# Altium project PD_SMARTKEY_EMN-EVAN_V2.0.PrjPcb
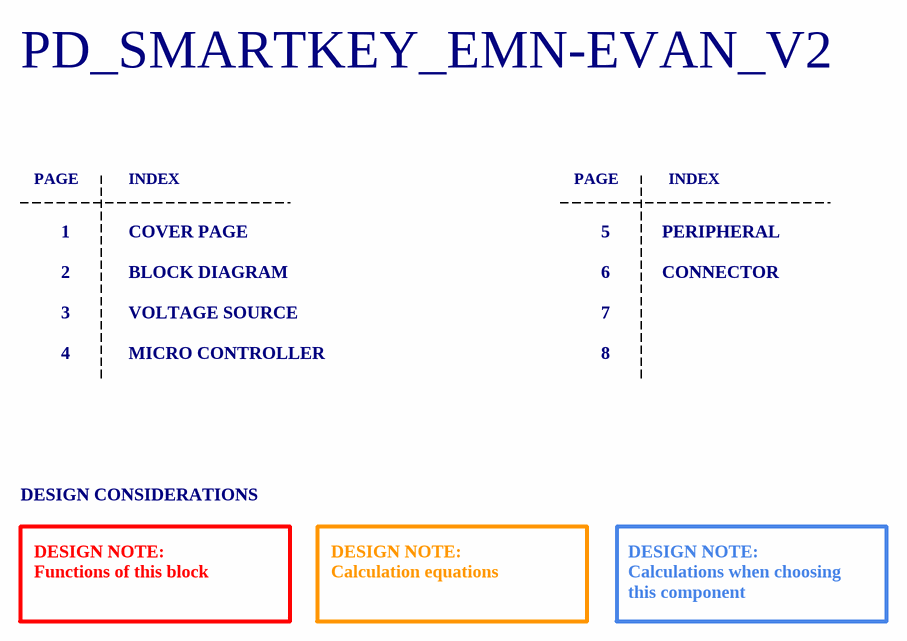
[diagram p0: Cover Page.SchDoc]
6 sheets, 132 parts. Net scope: global (net labels, ports and power ports of the same name join across sheets).
Board file: PD_SMARTKEY_EMN-EVAN_V2.0.PcbDoc
Sheets:
  Cover Page.SchDoc
  Block Diagram.SchDoc
  Voltage Source.SchDoc
  Micro Controller.SchDoc
  Peripheral.SchDoc
  Connector.SchDoc

## Sheet Cover Page.SchDoc
size A4; SheetNumber: 1; SheetTotal: 6; ProjectTitle: PD_SMARTKEY_EMN-EVAN_V2

### Notes on the sheet
- PD_SMARTKEY_EMN-EVAN_V2
- PAGE
- INDEX
- 1
- 2
- COVER PAGE
- BLOCK DIAGRAM
- 5
- 6
- PERIPHERAL
- CONNECTOR
- 3
- 4
- VOLTAGE SOURCE
- MICRO CONTROLLER
- 7
- 8
- DESIGN CONSIDERATIONS
- DESIGN NOTE:
  Functions of this block
- DESIGN NOTE:
  Calculation equations
- DESIGN NOTE:
  Calculations when choosing this component
- Author:
- Title:
- Size:
- A4
- Project:
- Approved:
- Revision:
- Modified Date:
- CONFIDENTIAL
- Date:
- SW Version:

## Sheet Block Diagram.SchDoc
size A4; SheetNumber: 2; SheetTotal: 6; ProjectTitle: PD_SMARTKEY_EMN-EVAN_V2

### Notes on the sheet
- Author:
- Title:
- Size:
- A4
- Project:
- Approved:
- Revision:
- Modified Date:
- CONFIDENTIAL
- Date:
- SW Version:

## Sheet Voltage Source.SchDoc
size A4; SheetNumber: 3; SheetTotal: 6; ProjectTitle: PD_SMARTKEY_EMN-EVAN_V2
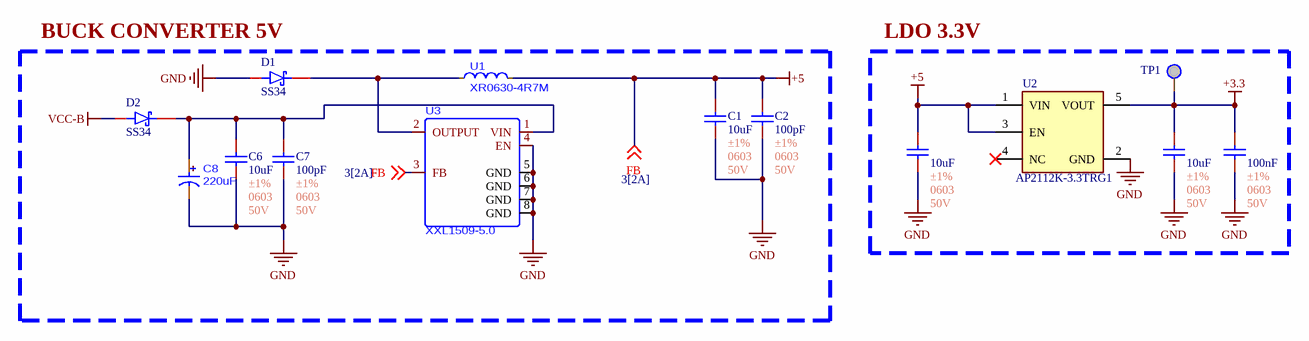
[diagram p1: Voltage Source.SchDoc]

### Parts
C1  10uF  Tolerance: ±1%  Package: 0603  Voltage Rating: 50V  [C0603]
C2  100pF  Tolerance: ±1%  Package: 0603  Voltage Rating: 50V  [C0603]
C3  10uF  Tolerance: ±1%  Package: 0603  Voltage Rating: 50V  [C0603]
C4  10uF  Tolerance: ±1%  Package: 0603  Voltage Rating: 50V  [C0603]
C5  100nF  Tolerance: ±1%  Package: 0603  Voltage Rating: 50V  [C0603]
C6  10uF  Tolerance: ±1%  Package: 0603  Voltage Rating: 50V  [C0603]
C7  100pF  Tolerance: ±1%  Package: 0603  Voltage Rating: 50V  [C0603]
C8  220uF  [C_220uF_35V_SMD]
D1  SS34  [SS34]
D2  SS34  [SS34]
TP1  TP  [TP]  (value not drawn)
U1  XR0630-4R7M  [SMD,7x6.6mm]
U2  AP2112K-3.3TRG1  [SOT23-5]
U3  XXL1509-5.0  [XXL1509-5.0]

### Blocks framed on the sheet
BUCK CONVERTER 5V: C1 C2 C6-C8 D1 D2 U1 U3
LDO 3.3V: C3-C5 TP1 U2

### Nets
+3.3: C4.1 C5.1 TP1.1 U2.5(VOUT)
+5: C1.1 C2.1 C3.1 U1.2(F) U2.1(VIN) U2.3(EN) U3.3(FB) ; off-sheet FB  [also labelled FB]
GND: C1.2 C2.2 C3.2 C4.2 C5.2 C6.2 C7.2 C8.2 D1.2 U2.2(GND) U3.4(EN) U3.5(GND) U3.6(GND) U3.7(GND) U3.8(GND)
VCC-B: D2.2
NetC6_1: C6.1 C7.1 C8.1 D2.1 U3.1(VIN)
NetD1_1: D1.1 U1.1(S) U3.2(OUTPUT)

Not connected (* = marked no-connect by the designer): U2 4(NC)*

### Notes on the sheet
- Author:
- Title:
- Size:
- A4
- Project:
- Approved:
- Revision:
- Modified Date:
- CONFIDENTIAL
- Date:
- SW Version:

### Library data of the parts
C1 C6 = C0603_10uF_±1%: Manufacturer: YAGEO; Mfr. Part #: CC0402FRNPO9BN100; LCSC Part #: C513681; Link: https://www.lcsc.com/product-detail/C513681.html?s_z=n_capital%2520yageo%252010pF%25200402; Capacitance: 10uF
C2 C7 = C0603_100pF_±1%: Manufacturer: YAGEO; Mfr. Part #: CC0402FRNPO9BN100; LCSC Part #: C513681; Link: https://www.lcsc.com/product-detail/C513681.html?s_z=n_capital%2520yageo%252010pF%25200402; Capacitance: 100pF
C3 C4 = C0603_10uF_±1%: 50V 10pF NP0 ±1% 0402 Multilayer Ceramic Capacitors MLCC - SMD/SMT ROHS; Manufacturer: YAGEO; Mfr. Part #: CC0402FRNPO9BN100; LCSC Part #: C513681; Link: https://www.lcsc.com/product-detail/C513681.html?s_z=n_capital%2520yageo%252010pF%25200402; Capacitance: 10uF
C5 = C0603_100nF_±1%: 50V 10pF NP0 ±1% 0402 Multilayer Ceramic Capacitors MLCC - SMD/SMT ROHS; Manufacturer: YAGEO; Mfr. Part #: CC0402FRNPO9BN100; LCSC Part #: C513681; Link: https://www.lcsc.com/product-detail/C513681.html?s_z=n_capital%2520yageo%252010pF%25200402; Capacitance: 100nF
C8 = C_220uF_35V_SMD: CAP ALUM 220uF ±20% 35V SMD; Manufacturer: ROQANG; Mfr. Part #: RVT1V221M0810; LCSC Part #: C72498; Package: SMD,D8xL10.2mm; Link: https://www.lcsc.com/product-detail/C72498.html?s_z=n_q_t_220u%252035v&spm=wm.fly.bg.0.xh___wm.ssy.tc.0.tz&lcsc_vid=FlRcBlcDRFNZAlJQT1RZBVJSEVFcX11eRVQPBFEHFgAxVlNeT1ReUlJRRFFYVTsOAxUeFF5JWBYZEEoKFBINSQcJGk4NBhADEA4cHktfT1FADxALGw%3D%3D
D1 D2 = SS34: 40V Independent 3A 550mV@3A SMA(DO-214AC) Schottky Diodes ROHS; Manufacturer: MDD(Microdiode Semiconductor); Mfr. Part #: SS34; LCSC Part #: C8678; Package: SMA(DO-214AC); Voltage - DC Reverse(Vr): 40V; Current - Rectified: 3A; Link: https://www.lcsc.com/product-detail/C8678.html?s_z=n_SS34
U1 = FIXED IND 4.7uH 6A 33mΩ SMD,0630: Manufacturer: XR; MPN: XR0630-4R7M; LCSC Part #: C5307631; Packaging: SMD,7x6.6mm; Link: https://www.lcsc.com/product-detail/C5307631.html?s_z=n_q_t_INDUCTOR%25200630&spm=wm.fly.bg.0.xh___wm.ssy.tc.0.tz&lcsc_vid=FFlaVlZURFlbX1EAE1lbUlZfQwdeBlBRQ1VZBFdQQwUxVlNeRlRfU1ZRQlNZXzsOAxUeFF5JWBYZEEoKFBINSQcJGk4eFQsCAgIaSgADAwAHC0slQ1ZXV1NWWQkaCgg%3D
U2 = AP2112K-3.3TRG1: Linear Voltage Regulator IC Positive Fixed 1 Output 600mA SOT23-5; MF: Diodes Inc.; Value: *; Purchase-URL: https://pricing.snapeda.com/search/part/AP2112K-3.3TRG1/?ref=eda; Package: SOT-753 Diodes Inc.; Availability: In Stock; Check_prices: https://www.snapeda.com/parts/AP2112K-3.3TRG1/Diodes+Inc./view-part/?ref=eda; Price: None; SnapEDA_Link: https://www.snapeda.com/parts/AP2112K-3.3TRG1/Diodes+Inc./view-part/?ref=snap; MP: AP2112K-3.3TRG1
U3 = XXL1509-5.0: 150KHz 3A PWM Buck DC/DC Converter; Manufacturer: UMW; MPN: XXL1509-5.0; LCSC Part #: C42376977; Packaging: SOP-8; Link: https://www.lcsc.com/product-detail/C42376977.html?s_z=n_q_xl1509&spm=wm.fly.bg.0.xh&lcsc_vid=FlRcBlcDRFNZAlJQT1RZBVJSEVFcX11eRVQPBFEHFgAxVlNeT1VdVlFURVJWXjsOAxUeFF5JWBYZEEoKFBINSQcJGk4eFQsCAgIaSgADAwAHC0slRVheUFFQQE8GEwkK

## Sheet Micro Controller.SchDoc
size A4; SheetNumber: 4; SheetTotal: 6; ProjectTitle: PD_SMARTKEY_EMN-EVAN_V2
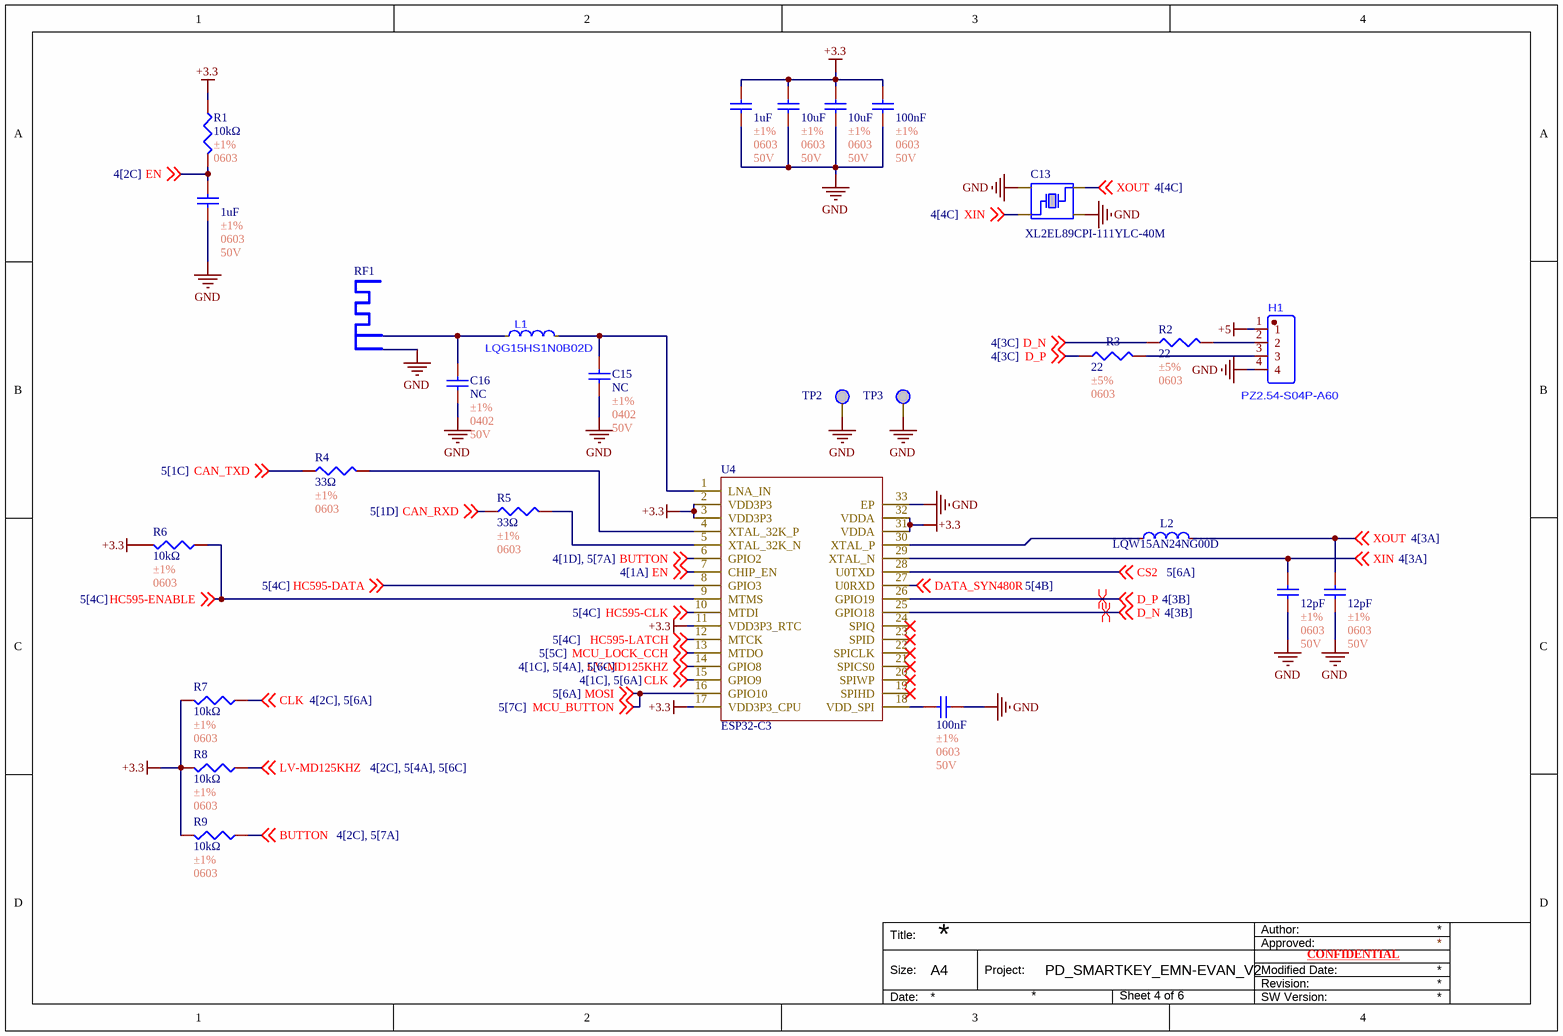
[diagram p2: Micro Controller.SchDoc]

### Parts
C9  1uF  Tolerance: ±1%  Package: 0603  Voltage Rating: 50V  [C0603]
C10  10uF  Tolerance: ±1%  Package: 0603  Voltage Rating: 50V  [C0603]
C11  10uF  Tolerance: ±1%  Package: 0603  Voltage Rating: 50V  [C0603]
C12  100nF  Tolerance: ±1%  Package: 0603  Voltage Rating: 50V  [C0603]
C13  XL2EL89CPI-111YLC-40M  [XL2EL89CPI-111YLC-40M]
C14  1uF  Tolerance: ±1%  Package: 0603  Voltage Rating: 50V  [C0603]
C15  NC  Tolerance: ±1%  Package: 0402  Voltage Rating: 50V  [C0402]
C16  NC  Tolerance: ±1%  Package: 0402  Voltage Rating: 50V  [C0402]
C17  12pF  Tolerance: ±1%  Package: 0603  Voltage Rating: 50V  [C0603]
C18  12pF  Tolerance: ±1%  Package: 0603  Voltage Rating: 50V  [C0603]
C19  100nF  Tolerance: ±1%  Package: 0603  Voltage Rating: 50V  [C0603]
H1  PZ2.54-S04P-A60  [J_4P_XH2.54]
L1  LQG15HS1N0B02D  [L0402_1nH]
L2  LQW15AN24NG00D  [LQW15AN24NG00D]
R1  10kΩ  Tolerance: ±1%  Package: 0603  [R0603]
R2  22  Tolerance: ±5%  Package: 0603  [R0603]
R3  22  Tolerance: ±5%  Package: 0603  [R0603]
R4  33Ω  Tolerance: ±1%  Package: 0603  [R0603]
R5  33Ω  Tolerance: ±1%  Package: 0603  [R0603]
R6  10kΩ  Tolerance: ±1%  Package: 0603  [R0603]
R7  10kΩ  Tolerance: ±1%  Package: 0603  [R0603]
R8  10kΩ  Tolerance: ±1%  Package: 0603  [R0603]
R9  10kΩ  Tolerance: ±1%  Package: 0603  [R0603]
RF1  (no value)  [2.4GHZ-50OHMS_v1.1]
TP2  TP  [TP]  (value not drawn)
TP3  TP  [TP]  (value not drawn)
U4  ESP32-C3  [ESP32-C3]

### Nets
+3.3: C9.1 C10.1 C11.1 C12.1 R1.1 R6.2 R7.2 R8.2 R9.2 U4.2(VDD3P3) U4.3(VDD3P3) U4.11(VDD3P3_RTC) U4.17(VDD3P3_CPU) U4.31(VDDA) U4.32(VDDA)
+5: H1.1
GND: C9.2 C10.2 C11.2 C12.2 C13.2 C13.4 C14.2 C15.2 C16.2 C17.2 C18.2 C19.2 H1.4 RF1.2 TP2.1 TP3.1 U4.33(EP)
BUTTON: R9.1 U4.6(GPIO2) ; off-sheet BUTTON
CAN_RXD: R5.1 ; off-sheet CAN_RXD
CAN_TXD: R4.1 ; off-sheet CAN_TXD
CLK: R7.1 U4.15(GPIO9) ; off-sheet CLK
CS2: U4.28(U0TXD) ; off-sheet CS2
D_N: R2.1 U4.25(GPIO18) ; off-sheet D_N
D_P: R3.1 U4.26(GPIO19) ; off-sheet D_P
DATA_SYN480R: U4.27(U0RXD) ; off-sheet DATA_SYN480R
EN: C14.1 R1.2 U4.7(CHIP_EN) ; off-sheet EN
HC595-CLK: U4.10(MTDI) ; off-sheet HC595-CLK
HC595-DATA: U4.8(GPIO3) ; off-sheet HC595-DATA
HC595-ENABLE: R6.1 U4.9(MTMS) ; off-sheet HC595-ENABLE
HC595-LATCH: U4.12(MTCK) ; off-sheet HC595-LATCH
LV-MD125KHZ: R8.1 U4.14(GPIO8) ; off-sheet LV-MD125KHZ
MCU_BUTTON: U4.16(GPIO10) ; off-sheet MOSI, off-sheet MCU_BUTTON  [also labelled MOSI]
MCU_LOCK_CCH: U4.13(MTDO) ; off-sheet MCU_LOCK_CCH
XIN: C13.1 C17.1 U4.29(XTAL_N) ; off-sheet XIN
XOUT: C13.3 C18.1 L2.2 ; off-sheet XOUT
NetC15_1: C15.1 L1.2 U4.1(LNA_IN)
NetC16_1: C16.1 L1.1 RF1.1
NetC19_1: C19.1 U4.18(VDD_SPI)
NetH1_2: H1.2 R2.2
NetH1_3: H1.3 R3.2
NetL2_1: L2.1 U4.30(XTAL_P)
NetR4_2: R4.2 U4.4(XTAL_32K_P)
NetR5_2: R5.2 U4.5(XTAL_32K_N)

Not connected (* = marked no-connect by the designer): U4 19(SPIHD)* 20(SPIWP)* 21(SPICS0)* 22(SPICLK)* 23(SPID)* 24(SPIQ)*

### Layout directives
differential pair: D_N, D_P

### Notes on the sheet
- Author:
- Title:
- Size:
- A4
- Project:
- Approved:
- Revision:
- Modified Date:
- CONFIDENTIAL
- Date:
- SW Version:

### Library data of the parts
C9 C14 = C0603_1uF_±1%: 50V 10pF NP0 ±1% 0402 Multilayer Ceramic Capacitors MLCC - SMD/SMT ROHS; Manufacturer: YAGEO; Mfr. Part #: CC0402FRNPO9BN100; LCSC Part #: C513681; Link: https://www.lcsc.com/product-detail/C513681.html?s_z=n_capital%2520yageo%252010pF%25200402; Capacitance: 1uF
C10 C11 = C0603_10uF_±1%: as C3 on sheet Voltage Source; LCSC Part #: C513681; Link: https://www.lcsc.com/product-detail/C513681.html?s_z=n_capital%2520yageo%252010pF%25200402; Capacitance: 10uF
C12 C19 = C0603_100nF_±1%: as C5 on sheet Voltage Source; LCSC Part #: C513681; Link: https://www.lcsc.com/product-detail/C513681.html?s_z=n_capital%2520yageo%252010pF%25200402; Capacitance: 100nF
C13 = XL2EL89CPI-111YLC-40M: Crystal Oscillator 15pF SMD3225-4P Crystals RoHS; Manufacturer: YXC Crystal Oscillators; Mfr. Part #: XL2EL89CPI-111YLC-40M; LCSC Part #: C5444549; Package: SMD3225-4P; Link: https://www.lcsc.com/product-detail/C5444549.html?s_z=n_oscillator; Key Attributes: Crystal Oscillator 15pF SMD3225-4P Crystals RoHS
C15 C16 = C0402_NC_±1%: Manufacturer: YAGEO; Mfr. Part #: CC0402FRNPO9BN100; Capacitance: 1uF; LCSC Part #: C513681; Link: https://www.lcsc.com/product-detail/C513681.html?s_z=n_capital%2520yageo%252010pF%25200402
C17 C18 = C0603_12pF_±1%: 50V 10pF NP0 ±1% 0402 Multilayer Ceramic Capacitors MLCC - SMD/SMT ROHS; Manufacturer: YAGEO; Mfr. Part #: CC0402FRNPO9BN100; LCSC Part #: C513681; Link: https://www.lcsc.com/product-detail/C513681.html?s_z=n_capital%2520yageo%252010pF%25200402; Capacitance: 12pF
H1 = J_4P_XH2.54: 1kV 1 2.54mm Pin Header 3A 2.5mm Through Hole 6mm -40℃~+105℃ 3mm Gold 4P Black 1x4P Through Hole,P=2.54mm Headers, Male Pins RoHS; Manufacturer: JXTCONN; MPN: PZ2.54-S04P-A60; LCSC Part #: C42431795; Packaging: Through Hole,P=2.54mm; Link: https://www.lcsc.com/product-detail/C42431795.html?s_z=n_q_t_header%25204%2520p&spm=wm.fly.bg.0.xh___wm.ssy.tc.0.tz&lcsc_vid=FlRcBlcDRFNZAlJQT1RZBVJSEVFcX11eRVQPBFEHFgAxVlNeQVVcV1RRRlFeUzsOAxUeFF5JWBYZEEoKFBINSQcJGk4dAgUUFAk%3D
L1 = L0402_1nH: FIXED IND 1nH 1A 70mΩ 0402; Manufacturer: muRata; MPN: LQG15HS1N0B02D; LCSC Part #: C162538; Packaging: 0402; Link: https://www.lcsc.com/product-detail/C162538.html?s_z=n_q_0402%2520inductor%25201nH&spm=wm.fly.bg.1.xh&lcsc_vid=FFlaVlZURFlbX1EAE1lbUlZfQwdeBlBRQ1VZBFdQQwUxVlNeQ1FfVlBVRFlZVjsOAxUeFF5JWBYZEEoKFBINSQcJGk4NBhADEA4cHktXRllfSQwSGg0%3D
L2 = LQW15AN24NG00D: FIXED IND 24nH 280mA 520mΩ 0402; Manufacturer: muRata; Mfr. Part #: LQW15AN24NG00D; LCSC Part #: C167472; Package: 0402; Link: https://www.lcsc.com/product-detail/C167472.html?s_z=n_q_inductor%252024nH%25200402&spm=wm.fly.bg.0.xh&lcsc_vid=FlRcBlcDRFNZAlJQT1RZBVJSEVFcX11eRVQPBFEHFgAxVlNeQVRfUFJVQVNZUzsOAxUeFF5JWBYZEEoKFBINSQcJGk4eFQsCAgIaSgADAwAHC0slRlhdU1RSWQkaCgg%3D
R1 R6-R9 = R0603_10kΩ_±1%: 62.5mW Thick Film Resistor 50V ±1% ±200ppm/℃ 10Ω 0402 Chip Resistor - Surface Mount ROHS; Manufacturer: YAGEO; Mfr. Part #: RC0402FR-0710RL; LCSC Part #: C138066; Resistance: 10kΩ; Link: https://www.lcsc.com/product-detail/C138066.html?s_z=n_resistor%25200402%252010R
R2 R3 = R0603_0Ω_±5%: 100mW Thick Film Resistor 75V ±5% 0Ω 0603 Chip Resistor - Surface Mount ROHS; Manufacturer: YAGEO; Mfr. Part #: RC0603JR-070RL; Key Attributes: RES 0Ω ±5% 100mW 0603; LCSC Part #: C95177; Resistance: 0Ω; Link: https://www.lcsc.com/product-detail/C138066.html?s_z=n_resistor%25200402%252010R
R4 R5 = R0603_33Ω_±5%: 100mW Thick Film Resistor 75V ±1% ±200ppm/℃ 2Ω 0603 Chip Resistor - Surface Mount ROHS; Manufacturer: YAGEO; Mfr. Part #: RC0603FR-072RL; Key Attributes: RES 0Ω ±5% 100mW 0603; LCSC Part #: C185341; Resistance: 33Ω; Link: https://www.lcsc.com/product-detail/C185341.html?s_z=n_resistor%2520yageo%25202%25CE%25A9%25200603
RF1 = Antenna
U4 = ESP32-C3: Others 160MHz QFN-32-EP(5x5) RF Transceiver Modules and Modems RoHS; Manufacturer: ESPRESSIF; LCSC Part #: C2838500; Package: QFN-32-EP(5x5); Link: https://www.lcsc.com/product-detail/C2838500.html?s_z=n_ESP32%2520C3; MPN: ESP32-C3

## Sheet Peripheral.SchDoc
size A3; SheetNumber: 5; SheetTotal: 6; ProjectTitle: PD_SMARTKEY_EMN-EVAN_V2
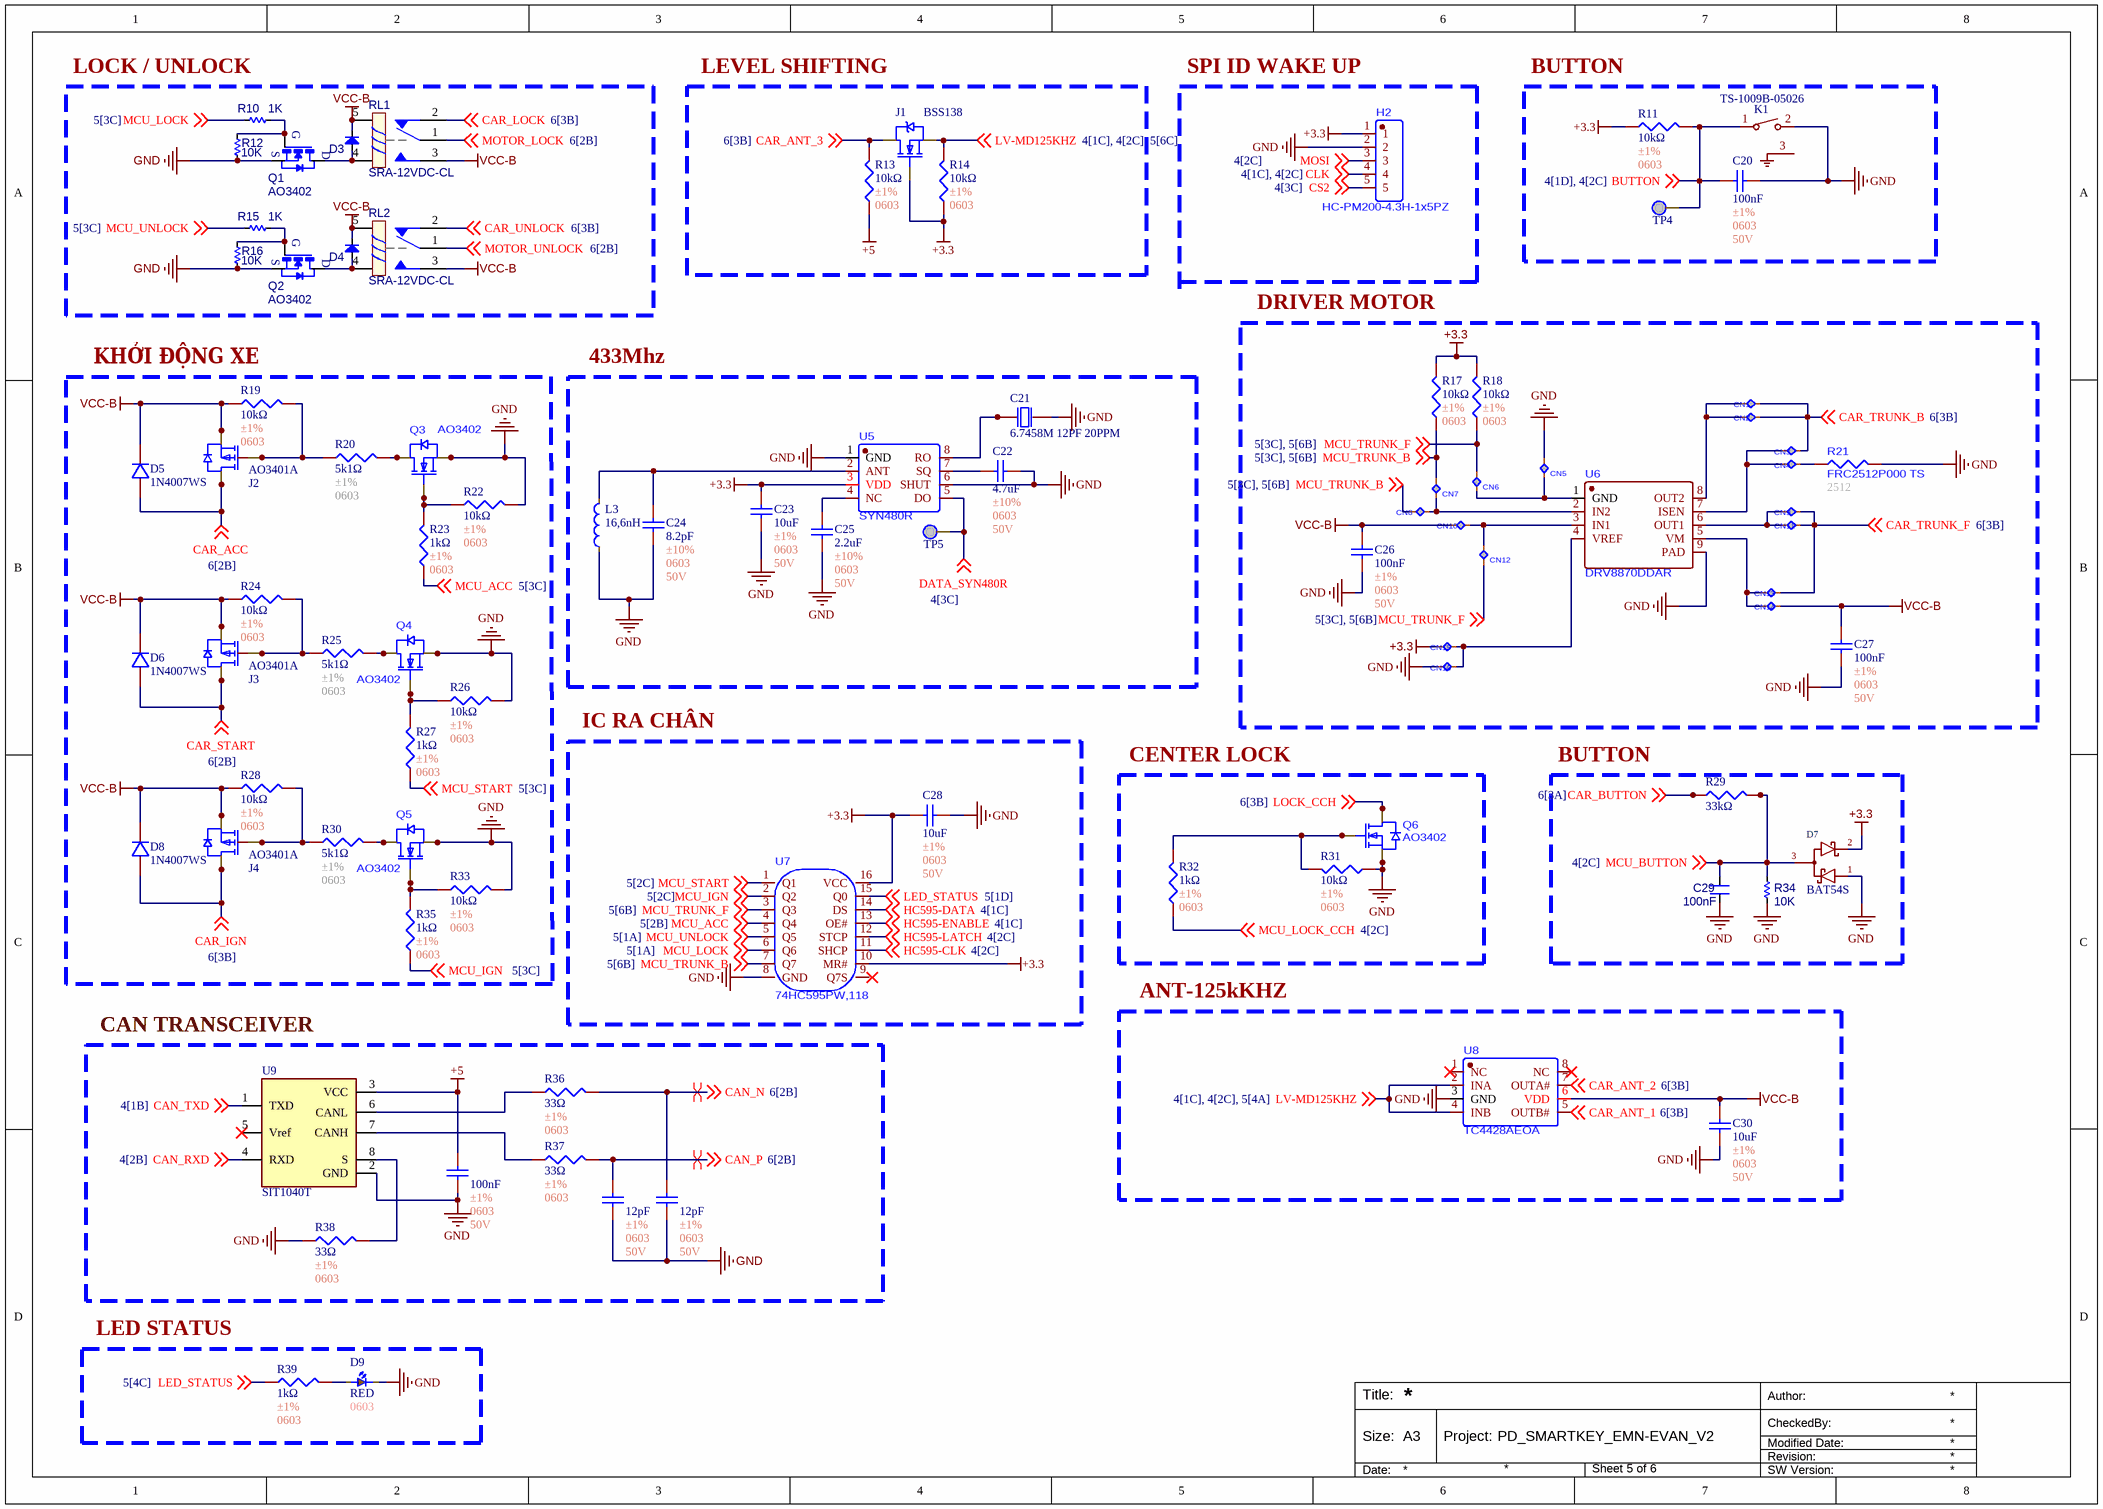
[diagram p3: Peripheral.SchDoc]

### Parts
C20  100nF  Tolerance: ±1%  Package: 0603  Voltage Rating: 50V  [C0603]
C21  6.7458M 12PF 20PPM  [6.7458M 12PF 20PPM]
C22  4.7uF  Tolerance: ±10%  Package: 0603  Voltage Rating: 50V  [C0603]
C23  10uF  Tolerance: ±1%  Package: 0603  Voltage Rating: 50V  [C0603]
C24  8.2pF  Tolerance: ±10%  Package: 0603  Voltage Rating: 50V  [C0603]
C25  2.2uF  Tolerance: ±10%  Package: 0603  Voltage Rating: 50V  [C0603]
C26  100nF  Tolerance: ±1%  Package: 0603  Voltage Rating: 50V  [C0603]
C27  100nF  Tolerance: ±1%  Package: 0603  Voltage Rating: 50V  [C0603]
C28  10uF  Tolerance: ±1%  Package: 0603  Voltage Rating: 50V  [C0603]
C29  100nF  [C-0603]
C30  10uF  Tolerance: ±1%  Package: 0603  Voltage Rating: 50V  [C0603]
C31  100nF  Tolerance: ±1%  Package: 0603  Voltage Rating: 50V  [C0603]
C32  12pF  Tolerance: ±1%  Package: 0603  Voltage Rating: 50V  [C0603]
C33  12pF  Tolerance: ±1%  Package: 0603  Voltage Rating: 50V  [C0603]
CN1  CN  [CN]  (value not drawn)
CN2  CN  [CN]  (value not drawn)
CN3  CN  [CN]  (value not drawn)
CN4  CN  [CN]  (value not drawn)
CN5  CN  [CN]  (value not drawn)
CN6  CN  [CN]  (value not drawn)
CN7  CN  [CN]  (value not drawn)
CN8  CN  [CN]  (value not drawn)
CN9  CN  [CN]  (value not drawn)
CN10  CN  [CN]  (value not drawn)
CN11  CN  [CN]  (value not drawn)
CN12  CN  [CN]  (value not drawn)
CN13  CN  [CN]  (value not drawn)
CN14  CN  [CN]  (value not drawn)
CN15  CN  [CN]  (value not drawn)
CN16  CN  [CN]  (value not drawn)
D3  1N5819  [SOD-323]  (value not drawn)
D4  1N5819  [SOD-323]  (value not drawn)
D5  1N4007WS  [1N4007WS]
D6  1N4007WS  [1N4007WS]
D7  BAT54S  [SOT23-3]
D8  1N4007WS  [1N4007WS]
D9  RED  Package: 0603  [LED0603]
H2  HC-PM200-4.3H-1x5PZ  [JC_5P_XH2.0]
J1  BSS138  [BSS138]
J2  AO3401A  [AO3401]
J3  AO3401A  [AO3401]
J4  AO3401A  [AO3401]
K1  TS-1009B-05026  [TS-1009B-05026]
L3  16,6nH  [L_16,6nH_0603]
Q1  AO3402  [SOT23-3]
Q2  AO3402  [SOT23-3]
Q3  AO3402  [AO3402]
Q4  AO3402  [AO3402]
Q5  AO3402  [AO3402]
Q6  AO3402  [AO3402]
R10  1K  [RES-SMD-0603]
R11  10kΩ  Tolerance: ±1%  Package: 0603  [R0603]
R12  10K  [RES-SMD-0603]
R13  10kΩ  Tolerance: ±1%  Package: 0603  [R0603]
R14  10kΩ  Tolerance: ±1%  Package: 0603  [R0603]
R15  1K  [RES-SMD-0603]
R16  10K  [RES-SMD-0603]
R17  10kΩ  Tolerance: ±1%  Package: 0603  [R0603]
R18  10kΩ  Tolerance: ±1%  Package: 0603  [R0603]
R19  10kΩ  Tolerance: ±1%  Package: 0603  [R0603]
R20  5k1Ω  Tolerance: ±1%  Package: 0603  [R0603]
R21  FRC2512P000 TS  Packaging: 2512  [R_2512_0O ±5%]
R22  10kΩ  Tolerance: ±1%  Package: 0603  [R0603]
R23  1kΩ  Tolerance: ±1%  Package: 0603  [R0603]
R24  10kΩ  Tolerance: ±1%  Package: 0603  [R0603]
R25  5k1Ω  Tolerance: ±1%  Package: 0603  [R0603]
R26  10kΩ  Tolerance: ±1%  Package: 0603  [R0603]
R27  1kΩ  Tolerance: ±1%  Package: 0603  [R0603]
R28  10kΩ  Tolerance: ±1%  Package: 0603  [R0603]
R29  33kΩ  [R0603]
R30  5k1Ω  Tolerance: ±1%  Package: 0603  [R0603]
R31  10kΩ  Tolerance: ±1%  Package: 0603  [R0603]
R32  1kΩ  Tolerance: ±1%  Package: 0603  [R0603]
R33  10kΩ  Tolerance: ±1%  Package: 0603  [R0603]
R34  10K  [RES-SMD-0603]
R35  1kΩ  Tolerance: ±1%  Package: 0603  [R0603]
R36  33Ω  Tolerance: ±1%  Package: 0603  [R0603]
R37  33Ω  Tolerance: ±1%  Package: 0603  [R0603]
R38  33Ω  Tolerance: ±1%  Package: 0603  [R0603]
R39  1kΩ  Tolerance: ±1%  Package: 0603  [R0603]
RL1  SRA-12VDC-CL  [YL318-DC12V-C]
RL2  SRA-12VDC-CL  [YL318-DC12V-C]
TP4  TP  [TP]  (value not drawn)
TP5  TP  [TP]  (value not drawn)
U5  SYN480R  [SYN480R]
U6  DRV8870DDAR  [DRV8870DDAR]
U7  74HC595PW,118  [74HC595PW,118]
U8  TC4428AEOA  [TC4428AEOA]
U9  SIT1040T  [SO8]

### Blocks framed on the sheet
LOCK / UNLOCK: D3 D4 Q1 Q2 R10 R12 R15 R16 RL1 RL2
LEVEL SHIFTING: J1 R13 R14
BUTTON: C20 K1 R11 TP4
DRIVER MOTOR: C26 C27 CN1-CN16 R17 R18 R21 U6
KHỞI ĐỘNG XE: D5 D6 D8 J2-J4 Q3-Q5 R19 R20 R22-R28 R30 R33 R35
433Mhz: C21-C25 L3 TP5 U5
IC RA CHÂN: C28 U7
CENTER LOCK: Q6 R31 R32
BUTTON: C29 D7 R29 R34
ANT-125kKHZ: C30 U8
CAN TRANSCEIVER: C31-C33 R36-R38 U9

### Nets
+3.3: C23.1 C28.1 CN15.1 D7.2(C) H2.1 J1.1(G) R11.1 R14.1 R17.2 R18.2 U5.3(VDD) U7.10(MR#) U7.16(VCC)
+5: C31.1 R13.1 U9.3(VCC)
GND: C20.1 C21.2(OSC2) C22.2 C23.2 C24.2 C25.2 C26.2 C27.2 C28.2 C29.1 C30.2 C31.2 C32.2 C33.2 CN5.1 CN16.1 D7.1(A) D9.1 H2.2 K1.2 L3.1 Q1.2(S) Q2.2(S) Q3.2(S) Q4.2(S) Q5.2(S) Q6.2(S) R12.1 R16.1 R21.2 R22.2 R26.2 R31.1 R33.2 R34.1 R38.1 U5.1(GND) U5.6(SHUT) U6.9(PAD) U7.8(GND) U8.3(GND) U9.2(GND)
VCC-B: C26.1 C27.1 C30.1 CN10.1 CN14.2 D3.2(K) D4.2(K) D5.1(K) D6.1(K) D8.1(K) J2.2(S) J3.2(S) J4.2(S) R19.1 R24.1 R28.1 RL1.3 RL1.5 RL2.3 RL2.5 U8.6(VDD)
BUTTON: C20.2 K1.1 R11.2 TP4.1 ; off-sheet BUTTON
CAN_N: C33.1 R36.2 ; off-sheet CAN_N
CAN_P: C32.1 R37.2 ; off-sheet CAN_P
CAN_RXD: U9.4(RXD) ; off-sheet CAN_RXD
CAN_TXD: U9.1(TXD) ; off-sheet CAN_TXD
CAR_ACC: D5.2(A) J2.3(D) ; off-sheet CAR_ACC
CAR_ANT_1: U8.5(OUTB#) ; off-sheet CAR_ANT_1
CAR_ANT_2: U8.7(OUTA#) ; off-sheet CAR_ANT_2
CAR_ANT_3: J1.3(D) R13.2 ; off-sheet CAR_ANT_3
CAR_BUTTON: R29.1 ; off-sheet CAR_BUTTON
CAR_IGN: D8.2(A) J4.3(D) ; off-sheet CAR_IGN
CAR_LOCK: RL1.2 ; off-sheet CAR_LOCK
CAR_START: D6.2(A) J3.3(D) ; off-sheet CAR_START
CAR_TRUNK_B: CN1.2 CN2.2 CN3.2 ; off-sheet CAR_TRUNK_B
CAR_TRUNK_F: CN9.2 CN11.2 CN13.2 ; off-sheet CAR_TRUNK_F
CAR_UNLOCK: RL2.2 ; off-sheet CAR_UNLOCK
CLK: H2.4 ; off-sheet CLK
CS2: H2.5 ; off-sheet CS2
DATA_SYN480R: TP5.1 U5.5(DO) ; off-sheet DATA_SYN480R
HC595-CLK: U7.11(SHCP) ; off-sheet HC595-CLK
HC595-DATA: U7.14(DS) ; off-sheet HC595-DATA
HC595-ENABLE: U7.13(OE#) ; off-sheet HC595-ENABLE
HC595-LATCH: U7.12(STCP) ; off-sheet HC595-LATCH
LED_STATUS: R39.1 U7.15(Q0) ; off-sheet LED_STATUS
LOCK_CCH: Q6.3(D) ; off-sheet LOCK_CCH
LV-MD125KHZ: J1.2(S) R14.2 U8.2(INA) U8.4(INB) ; off-sheet LV-MD125KHZ
MCU_ACC: R23.1 U7.4(Q4) ; off-sheet MCU_ACC
MCU_BUTTON: C29.2 D7.3 H2.3 R29.2 R34.2 ; off-sheet MOSI, off-sheet MCU_BUTTON  [also labelled MOSI]
MCU_IGN: R35.1 U7.2(Q2) ; off-sheet MCU_IGN
MCU_LOCK: R10.2 U7.6(Q6) ; off-sheet MCU_LOCK
MCU_LOCK_CCH: R32.1 ; off-sheet MCU_LOCK_CCH
MCU_START: R27.1 U7.1(Q1) ; off-sheet MCU_START
MCU_TRUNK_B: CN7.1 CN8.1 R17.1 U7.7(Q7) ; off-sheet MCU_TRUNK_B
MCU_TRUNK_F: CN6.1 CN12.1 R18.1 U7.3(Q3) ; off-sheet MCU_TRUNK_F
MCU_UNLOCK: R15.2 U7.5(Q5) ; off-sheet MCU_UNLOCK
MOTOR_LOCK: RL1.1 ; off-sheet MOTOR_LOCK
MOTOR_UNLOCK: RL2.1 ; off-sheet MOTOR_UNLOCK
NetC21_1: C21.1(OSC1) U5.8(RO)
NetC22_1: C22.1 U5.7(SQ)
NetC24_1: C24.1 L3.2 U5.2(ANT)
NetC25_1: C25.1 U5.4(NC)
NetCN1_1: CN1.1 CN2.1 U6.8(OUT2)
NetCN3_1: CN3.1 CN4.1 U6.7(ISEN)
NetCN4_2: CN4.2 R21.1
NetCN5_2: CN5.2 CN6.2 U6.1(GND)
NetCN7_2: CN7.2 CN8.2 U6.2(IN2)
NetCN9_1: CN9.1 CN11.1 U6.6(OUT1)
NetCN10_2: CN10.2 CN12.2 U6.3(IN1)
NetCN13_1: CN13.1 CN14.1 U6.5(VM)
NetCN15_2: CN15.2 CN16.2 U6.4(VREF)
NetD3_1: D3.1(A) Q1.3(D) RL1.4
NetD4_1: D4.1(A) Q2.3(D) RL2.4
NetD9_2: D9.2 R39.2
NetJ2_1: J2.1(G) R19.2 R20.1
NetJ3_1: J3.1(G) R24.2 R25.1
NetJ4_1: J4.1(G) R28.2 R30.1
NetQ1_1: Q1.1(G) R10.1 R12.2
NetQ2_1: Q2.1(G) R15.1 R16.2
NetQ3_1: Q3.1(G) R22.1 R23.2
NetQ3_3: Q3.3(D) R20.2
NetQ4_1: Q4.1(G) R26.1 R27.2
NetQ4_3: Q4.3(D) R25.2
NetQ5_1: Q5.1(G) R33.1 R35.2
NetQ5_3: Q5.3(D) R30.2
NetQ6_1: Q6.1(G) R31.2 R32.2
NetR36_1: R36.1 U9.6(CANL)
NetR37_1: R37.1 U9.7(CANH)
NetR38_2: R38.2 U9.8(S)

Not connected (* = marked no-connect by the designer): K1 3; U7 9(Q7S); U8 1(NC)* 8(NC)*; U9 5(Vref)*

### Layout directives
differential pair: CAN_N, CAN_P

### Notes on the sheet
- SPI ID WAKE UP
- LED STATUS
- Author:
- Title:
- Size:
- A3
- Project:
- Revision:
- Modified Date:
- CheckedBy:
- Date:
- SW Version:

### Library data of the parts
C20 C26 C27 = C0603_100nF_±1%: Manufacturer: YAGEO; Mfr. Part #: CC0402FRNPO9BN100; LCSC Part #: C513681; Link: https://www.lcsc.com/product-detail/C513681.html?s_z=n_capital%2520yageo%252010pF%25200402; Capacitance: 100nF
C21 = 6.7458M 12PF 20PPM: CRYSTAL 6.7458MHz 12pF SMD; Manufacturer: SOSET; Load Capacitance: 20pF; Mfr. Part #: 6.7458M 12PF 20PPM; LCSC Part #: C4944008; Package: HC-49S-SMD-2P-Mini; Link: https://www.lcsc.com/product-detail/C4944008.html?utm_source=chatgpt.com
C22 = C0603_4.7uF_±10%: Manufacturer: muRata; Mfr. Part #: GCJ188C70J335KE02D; Temperature Coefficient: X7S; LCSC Part #: C710616; Link: https://www.lcsc.com/product-detail/C710616.html?s_z=n_Capita%25200603%25203.3uF%2520yageo; Capacitance: 4.7uF
C23 C28 C30 = C0603_10uF_±1%: as C1 on sheet Voltage Source; LCSC Part #: C513681; Link: https://www.lcsc.com/product-detail/C513681.html?s_z=n_capital%2520yageo%252010pF%25200402; Capacitance: 10uF
C24 = C0603_8.2pF_±10%: Manufacturer: muRata; Mfr. Part #: GCJ188C70J335KE02D; Temperature Coefficient: X7S; LCSC Part #: C710616; Link: https://www.lcsc.com/product-detail/C710616.html?s_z=n_Capita%25200603%25203.3uF%2520yageo; Capacitance: 8.2pF
C25 = C0603_2.2uF_±10%: Manufacturer: muRata; Mfr. Part #: GCJ188C70J335KE02D; Temperature Coefficient: X7S; LCSC Part #: C710616; Link: https://www.lcsc.com/product-detail/C710616.html?s_z=n_Capita%25200603%25203.3uF%2520yageo; Capacitance: 2.2uF
C29 = CM: Cap SMD; Value: 103
C31 = C0603_100nF_±1%: as C5 on sheet Voltage Source; LCSC Part #: C513681; Link: https://www.lcsc.com/product-detail/C513681.html?s_z=n_capital%2520yageo%252010pF%25200402; Capacitance: 100nF
C32 C33 = C0603_12pF_±1%: as C17 on sheet Micro Controller; LCSC Part #: C513681; Link: https://www.lcsc.com/product-detail/C513681.html?s_z=n_capital%2520yageo%252010pF%25200402; Capacitance: 12pF
D3 D4 = Diode SMD: Default Diode; Code - JEDEC: DO-214-AB; Value: 1N5007; Published: 8-Jun-2000; Revision: July-2002: Re-released for DXP Platform.; Publisher: Altium Limited
D5 D6 D8 = 1N4007WS: DIODE STANDARD 1kV 1A SOD-323; Manufacturer: MDD(Microdiode Semiconductor); Mfr. Part #: 1N4007WS; LCSC Part #: C193404; Package: SOD-323; Link: https://www.lcsc.com/product-detail/C193404.html?utm_source=chatgpt.com
D7 = Schottky Dual Diode SMD: Diode 30V 0.2A Surface Mount SOT-23; ki_keywords: Dual Schottky Diode Series; ki_description: Dual Schottky Diode in Series; Datasheet: https://diotec.com/request/datasheet/bat54.pdf
D9 = D0603_RED: 25mcd~40mcd Water Clear -40℃~+85℃ 624nm Red 120° 60mW 0402 LED Indication - Discrete ROHS; Manufacturer: XINGLIGHT; Mfr. Part #: XL-1005UGC; Voltage - Forward(Vf): 3V; LCSC Part #: C965793; Power(Watts): 60mW; Link: https://www.lcsc.com/product-detail/C136765.html?s_z=n_LED%25200402%2520RED; Illumination Color: RED
H2 = JC_5P_XH2.0X_: CONN SOCKET 5POS 2mm SINGLE ROW TH; Manufacturer: Hong Cheng; MPN: HC-PM200-4.3H-1x5PZ; LCSC Part #: C22436139; Packaging: Through Hole,P=2mm; Link: https://www.lcsc.com/product-detail/C22436139.html?utm_source=chatgpt.com
J1 = BSS138: MOSFET N-CH 50V 0.22A SOT-23; Manufacturer: onsemi; Mfr. Part #: BSS138; LCSC Part #: C52895; Package: SOT-23; Link: https://www.lcsc.com/product-detail/C52895.html?s_z=n_q_x_bss138&spm=wm.ssy.em.0.tz&lcsc_vid=FFlaVlZURFlbX1EAE1lbUlZfQwdeBlBRQ1VZBFdQQwUxVlNeQlVeVVZeQlBWUTsOAxUeFF5JWBYZEEoKFBINSQcJGk4eFQsCAgIaSgADAwAHC0slTlBeX1dIHxUDCw%3D%3D
J2-J4 = AO3401: 30V 4A 900mV@250uA 1 P-Channel SOT-23 MOSFETs ROHS; Manufacturer: AOS; Mfr. Part #: AO3401A; LCSC Part #: C15127; Package: SOT-23; Current - Continuous Drain(Id): 4A; Drain to Source Voltage: 30V; Link: https://www.lcsc.com/product-detail/C15127.html?s_z=n_AO3401
K1 = TS-1009B-05026: SWITCH TACTILE SPST TH R/A; Manufacturer: XUNPU; Mfr. Part #: TS-1009B-05026; LCSC Part #: C455252; Package: Through Hole,Right Angle,4.5x4.5mm; Link: https://www.lcsc.com/product-detail/Tactile-Switches_XUNPU_C455252.html?utm_source=chatgpt.com
L3 = L_0603_16.6nH: 700mA 16nH ±5% 170mΩ Wire-wound inductor 0603 Fixed Inductors; Manufacturer: Coilank; Mfr. Part #: HWC1608J16ND; LCSC Part #: C54534274; Package: 0603; Link: https://www.lcsc.com/product-detail/C54534274.html?s_z=n_q_0603%252016nH&spm=wm.fly.bg.0.xh&lcsc_vid=FlRcBlcDRFNZAlJQT1RZBVJSEVFcX11eRVQPBFEHFgAxVlNeQFZdV1BVRFZWVjsOAxUeFF5JWBYZEEoKFBINSQcJGk4NBhADEA4cHktXRllfSQwSGg0%3D; Inductance: 16,6nH
Q1 Q2 = SI2302DS: N-Channel 20V 2.5A _Tc_ 830mW _Tc_ Surface Mount TO-236AB _SOT23_; MF: NXP Semiconductors; SnapEDA_Link: https://www.snapeda.com/parts/SI2302DS/NXP%20Semiconductors/view-part/4701514/?ref=snap; Availability: Unavailable; MP: SI2302DS; Price: None; Value: *; Package: None
Q3-Q6 = AO3402: MOSFET N-CH 30V SOT-23; Manufacturer: AOS; MPN: AO3402; LCSC Part #: C14385; Packaging: SOT-23; Link: https://www.lcsc.com/product-detail/C14385.html?s_z=n_q_ao3402&spm=wm.fly.bg.0.xh&lcsc_vid=FFlaVlZURFlbX1EAE1lbUlZfQwdeBlBRQ1VZBFdQQwUxVlNeRVZXVF1QQ1BYXzsOAxUeFF5JWBYZEEoKFBINSQcJGk4NBhADEA4cHktXR1FWSQwSGg0%3D
R10 R12 R15 R16 R34 = Res-SMD: Resistor; Manufacturer: Generic Components; Class: Passive; Published: 08/06/2000; Publisher: Altium Hobart Technology Centre
R11 R13 R14 R17-R19 R22 R24 R26 R28 R31 R33 = R0603_10kΩ_±1%: as R1 on sheet Micro Controller; LCSC Part #: C138066; Resistance: 10kΩ; Link: https://www.lcsc.com/product-detail/C138066.html?s_z=n_resistor%25200402%252010R
R20 R25 R30 = R0603_5k1Ω_±1%: 100mW Thick Film Resistor 75V ±100ppm/℃ ±1% 5.1kΩ 0603 Chip Resistor - Surface Mount ROHS; Manufacturer: FOJAN; Mfr. Part #: FRC0603F5101TS; Key Attributes: RES 5.1kΩ ±1% 100mW 0603; LCSC Part #: C2907044; Link: https://www.lcsc.com/product-detail/C2907044.html?s_z=n_5k1%25200603; Resistance: 5k1Ω
R21 = R_2512_0Ω ±5%: RES 0Ω ±5% 1W 2512; Manufacturer: FOJAN; MPN: FRC2512P000 TS; LCSC Part #: C2907567; Link: https://www.lcsc.com/product-detail/C2907567.html?s_z=n_q_t_2512%25200R&spm=wm.fly.bg.0.xh___wm.ssy.tc.0.tz&lcsc_vid=FlRcBlcDRFNZAlJQT1RZBVJSEVFcX11eRVQPBFEHFgAxVlNeT1VcVV1UR1dZVTsOAxUeFF5JWBYZEEoKFBINSQcJGk4eFQsCAgIaSgADAwAHC0slT1dbXlRIHxUDCw%3D%3D
R23 R27 R32 R35 R39 = R0603_1kΩ_±1%: 62.5mW Thick Film Resistor 50V ±1% ±200ppm/℃ 10Ω 0402 Chip Resistor - Surface Mount ROHS; Manufacturer: YAGEO; Mfr. Part #: RC0402FR-0710RL; LCSC Part #: C138066; Resistance: 1kΩ; Link: https://www.lcsc.com/product-detail/C138066.html?s_z=n_resistor%25200402%252010R
R29 = R0603_33kΩ_±1%: Manufacturer: YAGEO; Resistance: 33kΩ
R36-R38 = R0603_33Ω_±5%: as R4 on sheet Micro Controller; LCSC Part #: C185341; Resistance: 33Ω; Link: https://www.lcsc.com/product-detail/C185341.html?s_z=n_resistor%2520yageo%25202%25CE%25A9%25200603
RL1 RL2 = Relay 1: Relay SPDT,10A - 12VDC 5 Pin; Value: Relay SPDT, 10A, 12V
U5 = SYN480R: 433/315 MHz wireless receiver chips; Manufacturer: JSMSEMI; MPN: SYN480R; LCSC Part #: C916347; Packaging: SOP-8; Link: https://www.lcsc.com/product-detail/C916347.html?s_z=n_q_SYN480R&spm=wm.fly.bg.0.xh&lcsc_vid=FlRcBlcDRFNZAlJQT1RZBVJSEVFcX11eRVQPBFEHFgAxVlNeQVVdUFxQR1VXUDsOAxUeFF5JWBYZEEoKFBINSQcJGk4eFQsCAgIaSgADAwAHC0sRHhMLShAJWgMBBhYCWgIBCQoDFBUBFTsLEgYPFBAHBUwUH0kODlNDV0lVBxYaOCdRQ1NXUlNWWQkaCgg%3D
U6 = DRV8870DDAR: Brushed DC motor driver (PWM control); Manufacturer: TI; MPN: DRV8870DDAR; LCSC Part #: C86590; Packaging: HSOP-8-EP; Link: https://www.lcsc.com/product-detail/C86590.html?s_z=n_q_DRV8870&spm=wm.fly.bg.1.xh&lcsc_vid=FlRcBlcDRFNZAlJQT1RZBVJSEVFcX11eRVQPBFEHFgAxVlNeT1VcV1ZUQVZXXzsOAxUeFF5JWBYZEEoKFBINSQcJGk4%3D
U7 = 74HC595PW,118: 8-bit serial-in, serial or parallel-out shift register with output latches; 3-state; Manufacturer: Nexperia; MPN: 74HC595PW,118; LCSC Part #: C5948; Packaging: TSSOP-16; Link: https://www.lcsc.com/product-detail/C5948.html?utm_source=chatgpt.com
U8 = TC4428AEOA: 1.5A Dual High-Speed Power MOSFET Drivers; Manufacturer: MICROCHIP; MPN: TC4428AEOA; LCSC Part #: C636894; Packaging: SOIC-8; Link: https://www.lcsc.com/product-detail/C636894.html?s_z=n_q_TC4428AE&spm=wm.fly.bg.3.xh&lcsc_vid=FlRcBlcDRFNZAlJQT1RZBVJSEVFcX11eRVQPBFEHFgAxVlNeT1VdVVVeQ1FZUjsOAxUeFF5JWBYZEEoKFBINSQcJGk4NBhADEA4cHktXR1NXSQwSGg0%3D
U9 = TJA1050: 1/1 Transceiver Half CANbus 8-SO; MF: NXP USA; Package: SOIC-8 NXP USA; Value: *; Availability: Unavailable; SnapEDA_Link: https://www.snapeda.com/parts/TJA1050/NXP%20USA%20Inc./view-part/562764/?ref=snap; Price: None; MP: TJA1050

## Sheet Connector.SchDoc
size A4; SheetNumber: 6; SheetTotal: 6; ProjectTitle: PD_SMARTKEY_EMN-EVAN_V2
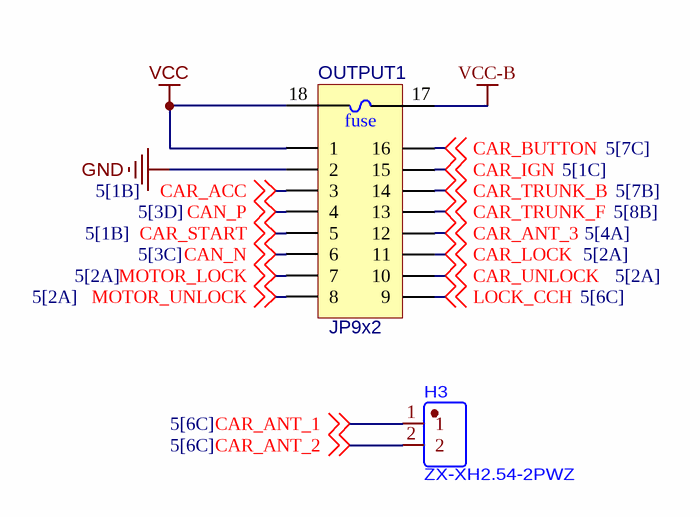
[diagram p4: Connector.SchDoc]

### Parts
H3  ZX-XH2.54-2PWZ  [ZX-XH2.54-2PWZ]
OUTPUT1  JP9x2  [9x2_JP200]

### Nets
GND: OUTPUT1.2
VCC: OUTPUT1.1 OUTPUT1.18
VCC-B: OUTPUT1.17
CAN_N: OUTPUT1.6 ; off-sheet CAN_N
CAN_P: OUTPUT1.4 ; off-sheet CAN_P
CAR_ACC: OUTPUT1.3 ; off-sheet CAR_ACC
CAR_ANT_1: H3.1 ; off-sheet CAR_ANT_1
CAR_ANT_2: H3.2 ; off-sheet CAR_ANT_2
CAR_ANT_3: OUTPUT1.12 ; off-sheet CAR_ANT_3
CAR_BUTTON: OUTPUT1.16 ; off-sheet CAR_BUTTON
CAR_IGN: OUTPUT1.15 ; off-sheet CAR_IGN
CAR_LOCK: OUTPUT1.11 ; off-sheet CAR_LOCK
CAR_START: OUTPUT1.5 ; off-sheet CAR_START
CAR_TRUNK_B: OUTPUT1.14 ; off-sheet CAR_TRUNK_B
CAR_TRUNK_F: OUTPUT1.13 ; off-sheet CAR_TRUNK_F
CAR_UNLOCK: OUTPUT1.10 ; off-sheet CAR_UNLOCK
LOCK_CCH: OUTPUT1.9 ; off-sheet LOCK_CCH
MOTOR_LOCK: OUTPUT1.7 ; off-sheet MOTOR_LOCK
MOTOR_UNLOCK: OUTPUT1.8 ; off-sheet MOTOR_UNLOCK

### Notes on the sheet
- Author:
- Title:
- Size:
- A4
- Project:
- Approved:
- Revision:
- Modified Date:
- CONFIDENTIAL
- Date:
- SW Version:
- (in symbol JP9x2_1) fuse

### Library data of the parts
H3 = ZX-XH2.54-2PWZ: CONN HEADER TH R/A 2POS 2.5mm; Manufacturer: Megastar; MPN: ZX-XH2.54-2PWZ; LCSC Part #: C7429641; Packaging: Through Hole,Right Angle,P=2.5mm; Link: https://www.lcsc.com/product-detail/C7429641.html?utm_source=chatgpt.com
OUTPUT1 = JP9x2_1: WR-PHD 2.54 mm Dual Socket Header; Manufacturer: W¨¹rth Elektronik eiSos GmbH; partNo: 61301821821; ComponentLink1 Description: Manufacturer; ComponentLink2 Description: Datasheet; NoPins: 18; Created Date: 29 March 2013; ComponentLink1URL: http://www.we-online.com; ComponentLink2URL: http://katalog.we-online.de/em/datasheet/6130xx21821.pdf; Created by: Karrer Zheng

## Nets that join several sheets
+3.3: Voltage Source (C4.1 C5.1 TP1.1 U2.5), Micro Controller (15 pins), Peripheral (13 pins)
+5: Voltage Source (7 pins), Micro Controller (H1.1), Peripheral (C31.1 R13.1 U9.3)
GND: Voltage Source (15 pins), Micro Controller (17 pins), Peripheral (42 pins), Connector (OUTPUT1.2)
VCC-B: Voltage Source (D2.2), Peripheral (21 pins), Connector (OUTPUT1.17)
BUTTON: Micro Controller (R9.1 U4.6), Peripheral (C20.2 K1.1 R11.2 TP4.1)
CAN_N: Peripheral (C33.1 R36.2), Connector (OUTPUT1.6)
CAN_P: Peripheral (C32.1 R37.2), Connector (OUTPUT1.4)
CAN_RXD: Micro Controller (R5.1), Peripheral (U9.4)
CAN_TXD: Micro Controller (R4.1), Peripheral (U9.1)
CAR_ACC: Peripheral (D5.2 J2.3), Connector (OUTPUT1.3)
CAR_ANT_1: Peripheral (U8.5), Connector (H3.1)
CAR_ANT_2: Peripheral (U8.7), Connector (H3.2)
CAR_ANT_3: Peripheral (J1.3 R13.2), Connector (OUTPUT1.12)
CAR_BUTTON: Peripheral (R29.1), Connector (OUTPUT1.16)
CAR_IGN: Peripheral (D8.2 J4.3), Connector (OUTPUT1.15)
CAR_LOCK: Peripheral (RL1.2), Connector (OUTPUT1.11)
CAR_START: Peripheral (D6.2 J3.3), Connector (OUTPUT1.5)
CAR_TRUNK_B: Peripheral (CN1.2 CN2.2 CN3.2), Connector (OUTPUT1.14)
CAR_TRUNK_F: Peripheral (CN9.2 CN11.2 CN13.2), Connector (OUTPUT1.13)
CAR_UNLOCK: Peripheral (RL2.2), Connector (OUTPUT1.10)
CLK: Micro Controller (R7.1 U4.15), Peripheral (H2.4)
CS2: Micro Controller (U4.28), Peripheral (H2.5)
DATA_SYN480R: Micro Controller (U4.27), Peripheral (TP5.1 U5.5)
HC595-CLK: Micro Controller (U4.10), Peripheral (U7.11)
HC595-DATA: Micro Controller (U4.8), Peripheral (U7.14)
HC595-ENABLE: Micro Controller (R6.1 U4.9), Peripheral (U7.13)
HC595-LATCH: Micro Controller (U4.12), Peripheral (U7.12)
LOCK_CCH: Peripheral (Q6.3), Connector (OUTPUT1.9)
LV-MD125KHZ: Micro Controller (R8.1 U4.14), Peripheral (J1.2 R14.2 U8.2 U8.4)
MCU_BUTTON: Micro Controller (U4.16), Peripheral (5 pins)
MCU_LOCK_CCH: Micro Controller (U4.13), Peripheral (R32.1)
MOTOR_LOCK: Peripheral (RL1.1), Connector (OUTPUT1.7)
MOTOR_UNLOCK: Peripheral (RL2.1), Connector (OUTPUT1.8)